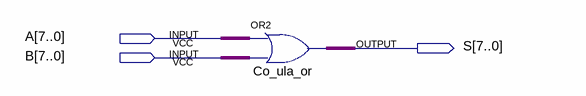
[diagram p0: schematic sheet]
// Quartus schematic or8x8.bdf as structural Verilog: 1 symbols, 3 pins
module or8x8 (
  input  [7:0] A,
  input  [7:0] B,
  output [7:0] S
);

  assign S = A | B;  // OR2 Co_ula_or, 8 bits wide
endmodule
